# Altium schematic sheet ESP32.SchDoc
size B; SheetNumber: 1; SheetTotal: 2
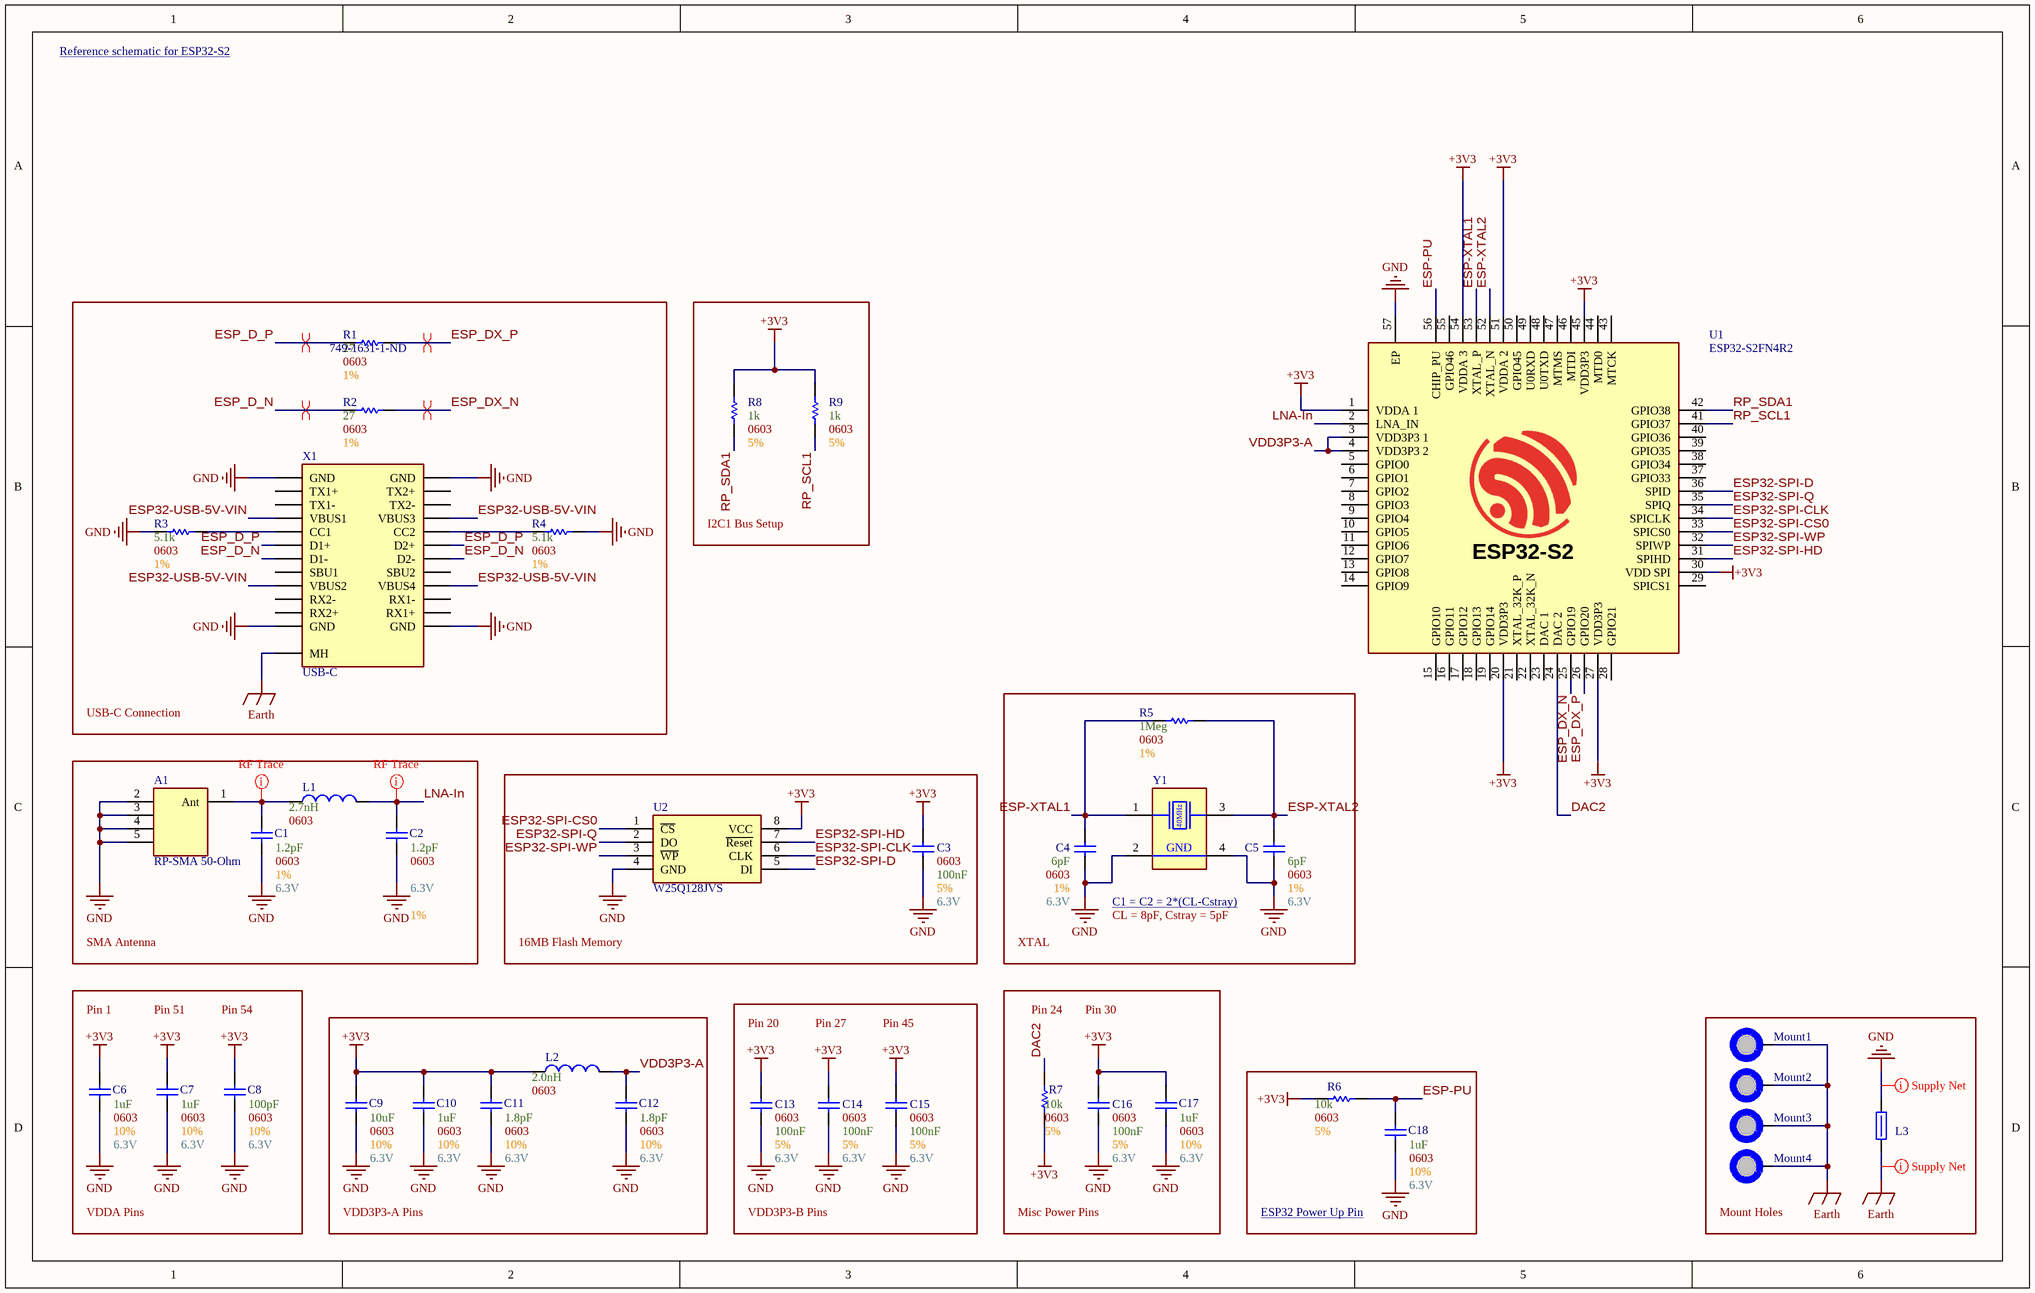
[diagram p0: ESP32.SchDoc]

## Parts
A1  RP-SMA 50-Ohm  [[SMA] RP-SMA 90deg Jack]
C1  Voltage: 6.3V  Tolerance: 1%  Size Package: 0603  Capacitance: 1.2pF  [[Cap] SMD 0603]  (hidden comment: SMD Nonpolarized)
C2  Voltage: 6.3V  Tolerance: 1%  Size Package: 0603  Capacitance: 1.2pF  [[Cap] SMD 0603]  (hidden comment: SMD Nonpolarized)
C3  Size Package: 0603  Capacitance: 100nF  Voltage: 6.3V  Tolerance: 5%  [[Cap] SMD 0603]  (hidden comment: [Cap] SMD Nonpolarized)
C4  Voltage: 6.3V  Tolerance: 1%  Size Package: 0603  Capacitance: 6pF  [[Cap] SMD 0603]  (hidden comment: SMD Nonpolarized)
C5  Voltage: 6.3V  Tolerance: 1%  Size Package: 0603  Capacitance: 6pF  [[Cap] SMD 0603]  (hidden comment: SMD Nonpolarized)
C6  Voltage: 6.3V  Tolerance: 10%  Size Package: 0603  Capacitance: 1uF  [[Cap] SMD 0603]  (hidden comment: SMD Nonpolarized)
C7  Voltage: 6.3V  Tolerance: 10%  Size Package: 0603  Capacitance: 1uF  [[Cap] SMD 0603]  (hidden comment: SMD Nonpolarized)
C8  Voltage: 6.3V  Tolerance: 10%  Size Package: 0603  Capacitance: 100pF  [[Cap] SMD 0603]  (hidden comment: SMD Nonpolarized)
C9  Voltage: 6.3V  Tolerance: 10%  Size Package: 0603  Capacitance: 10uF  [[Cap] SMD 0603]  (hidden comment: SMD Nonpolarized)
C10  Voltage: 6.3V  Tolerance: 10%  Size Package: 0603  Capacitance: 1uF  [[Cap] SMD 0603]  (hidden comment: SMD Nonpolarized)
C11  Voltage: 6.3V  Tolerance: 10%  Size Package: 0603  Capacitance: 1.8pF  [[Cap] SMD 0603]  (hidden comment: SMD Nonpolarized)
C12  Voltage: 6.3V  Tolerance: 10%  Size Package: 0603  Capacitance: 1.8pF  [[Cap] SMD 0603]  (hidden comment: SMD Nonpolarized)
C13  Size Package: 0603  Capacitance: 100nF  Voltage: 6.3V  Tolerance: 5%  [[Cap] SMD 0603]  (hidden comment: [Cap] SMD Nonpolarized)
C14  Size Package: 0603  Capacitance: 100nF  Voltage: 6.3V  Tolerance: 5%  [[Cap] SMD 0603]  (hidden comment: [Cap] SMD Nonpolarized)
C15  Size Package: 0603  Capacitance: 100nF  Voltage: 6.3V  Tolerance: 5%  [[Cap] SMD 0603]  (hidden comment: [Cap] SMD Nonpolarized)
C16  Size Package: 0603  Capacitance: 100nF  Voltage: 6.3V  Tolerance: 5%  [[Cap] SMD 0603]  (hidden comment: [Cap] SMD Nonpolarized)
C17  Voltage: 6.3V  Tolerance: 10%  Size Package: 0603  Capacitance: 1uF  [[Cap] SMD 0603]  (hidden comment: SMD Nonpolarized)
C18  Voltage: 6.3V  Tolerance: 10%  Size Package: 0603  Capacitance: 1uF  [[Cap] SMD 0603]  (hidden comment: SMD Nonpolarized)
L1  Size Package: 0603  Inductance: 2.7nH  [[Inductor] SMD 0603]  (hidden comment: SMD Inductor)
L2  Size Package: 0603  Inductance: 2.0nH  [[Inductor] SMD 0603]  (hidden comment: SMD Inductor)
L3  652-MH2029-300Y  [[Ferrite] SMD Bead 0805 (1)]  (value not drawn)
Mount1  M3 Mount Hole  [[Mount] M3 Mount Hole]  (value not drawn)  (no BOM)
Mount2  M3 Mount Hole  [[Mount] M3 Mount Hole]  (value not drawn)  (no BOM)
Mount3  M3 Mount Hole  [[Mount] M3 Mount Hole]  (value not drawn)  (no BOM)
Mount4  M3 Mount Hole  [[Mount] M3 Mount Hole]  (value not drawn)  (no BOM)
R1  Tolerance: 1%  Resistance: 27  Size Package: 0603  Supplier Part Number 1: 749-1631-1-ND  [[Res] SMD 0603]  (hidden comment: [Res] SMD Resistor)
R2  Tolerance: 1%  Resistance: 27  Size Package: 0603  [[Res] SMD 0603]  (hidden comment: [Res] SMD Resistor)
R3  Tolerance: 1%  Resistance: 5.1k  Size Package: 0603  [[Res] SMD 0603]  (hidden comment: [Res] SMD Resistor)
R4  Tolerance: 1%  Resistance: 5.1k  Size Package: 0603  [[Res] SMD 0603]  (hidden comment: [Res] SMD Resistor)
R5  Tolerance: 1%  Resistance: 1Meg  Size Package: 0603  [[Res] SMD 0603]  (hidden comment: [Res] SMD Resistor)
R6  Tolerance: 5%  Resistance: 10k  Size Package: 0603  [[Res] SMD 0603]  (hidden comment: [Res] SMD Resistor)
R7  Tolerance: 5%  Resistance: 10k  Size Package: 0603  [[Res] SMD 0603]  (hidden comment: [Res] SMD Resistor)
R8  Resistance: 1k  Size Package: 0603  Tolerance: 5%  [[Res] SMD 0603]  (hidden comment: [Res] SMD Resistor)
R9  Resistance: 1k  Size Package: 0603  Tolerance: 5%  [[Res] SMD 0603]  (hidden comment: [Res] SMD Resistor)
U1  ESP32-S2FN4R2  [[MCU] ESP32-S2]
U2  W25Q128JVS  [[Mem] 16Mb Flash Memory]
X1  USB-C  [[Port] USB-C]
Y1  40MHz Crystal  [[XTAL] SMD 40MHz]  (value not drawn)

## Blocks framed on the sheet
USB-C Connection: R1-R4 X1
I2C1 Bus Setup: R8 R9
SMA Antenna: A1 C1 C2 L1
16MB Flash Memory: C3 U2
VDD3P3-A Pins: C9-C12 L2
Mount Holes: L3 Mount1-Mount4
ESP32 Power Up Pin: C18 R6

## Nets
+3V3: C3.2 C6.2 C7.2 C8.2 C9.2 C10.2 C11.2 C13.2 C14.2 C15.2 C16.2 C17.2 L2.1 R6.1 R7.1 R8.2 R9.2 U1.1(VDDA_1) U1.20(VDD3P3) U1.27(VDD3P3) U1.30(VDD_SPI) U1.45(VDD3P3) U1.51(VDDA_2) U1.54(VDDA_3) U2.8(VCC)
Earth: L3.1 Mount1.1 Mount2.1 Mount3.1 Mount4.1 X1.MH
GND: A1.2 A1.3 A1.4 A1.5 C1.1 C2.1 C3.1 C4.1 C5.1 C6.1 C7.1 C8.1 C9.1 C10.1 C11.1 C12.1 C13.1 C14.1 C15.1 C16.1 C17.1 C18.1 L3.2 R3.1 R4.2 U1.57(EP) U2.4(GND) X1.A1(GND) X1.A12(GND) X1.B1(GND) X1.B12(GND) Y1.2(GND) Y1.4(GND)
DAC2: R7.2 U1.24(DAC_2)
ESP32-SPI-CLK: U1.34(SPICLK) U2.6(CLK)
ESP32-SPI-CS0: U1.33(SPICS0) U2.1(~{CS})
ESP32-SPI-D: U1.36(SPID) U2.5(DI)
ESP32-SPI-HD: U1.31(SPIHD) U2.7(~{Reset})
ESP32-SPI-Q: U1.35(SPIQ) U2.2(DO)
ESP32-SPI-WP: U1.32(SPIWP) U2.3(~{WP})
ESP32-USB-5V-VIN: X1.A4(VBUS1) X1.A9(VBUS2) X1.B4(VBUS3) X1.B9(VBUS4)
ESP-PU: C18.2 R6.2 U1.56(CHIP_PU)
ESP-XTAL1: C4.2 R5.2 U1.53(XTAL_P) Y1.1(XTAL1)
ESP-XTAL2: C5.2 R5.1 U1.52(XTAL_N) Y1.3(XTAL2)
ESP_D_N: R2.1 X1.A7(D1-) X1.B7(D2-)
ESP_D_P: R1.1 X1.A6(D1+) X1.B6(D2+)
ESP_DX_N: R2.2 U1.25(GPIO19)
ESP_DX_P: R1.2 U1.26(GPIO20)
LNA-In: C2.2 L1.2 U1.2(LNA_IN)
RP_SCL1: R9.1 U1.41(GPIO37)
RP_SDA1: R8.1 U1.42(GPIO38)
VDD3P3-A: C12.2 L2.2 U1.3(VDD3P3_1) U1.4(VDD3P3_2)
NetA1_1: A1.1(Ant) C1.2 L1.1
NetR3_2: R3.2 X1.A5(CC1)
NetR4_1: R4.1 X1.B5(CC2)

Not connected (* = marked no-connect by the designer): U1 5(GPIO0) 6(GPIO1) 7(GPIO2) 8(GPIO3) 9(GPIO4) 10(GPIO5) 11(GPIO6) 12(GPIO7) 13(GPIO8) 14(GPIO9) 15(GPIO10) 16(GPIO11) 17(GPIO12) 18(GPIO13) 19(GPIO14) 21(XTAL_32K_P) 22(XTAL_32K_N) 23(DAC_1) 28(GPIO21) 29(SPICS1) 37(GPIO33) 38(GPIO34) 39(GPIO35) 40(GPIO36) 43(MTCK) 44(MTD0) 46(MTDI) 47(MTMS) 48(U0TXD) 49(U0RXD) 50(GPIO45) 55(GPIO46); X1 A2(TX1+) A3(TX1-) A8(SBU1) A10(RX2-) A11(RX2+) B2(TX2+) B3(TX2-) B8(SBU2) B10(RX1-) B11(RX1+)

## Layout directives
differential pair: ESP_D_N, ESP_D_P, ESP_DX_P
differential pair; differential pair class USB_Pairs: ESP_DX_N
net class nRF Signal: LNA-In, NetA1_1
net class Supply_Nets: Earth, GND

## Notes on the sheet
- Reference schematic for ESP32-S2 <https://docs.espressif.com/projects/esp-hardware-design-guidelines/en/latest/esp32s2/_images/esp32s2-sche-core.png>
- C1 = C2 = 2*(CL-Cstray) <https://microchip.my.site.com/s/article/Calculating-crystal-load-capacitor>
- XTAL
- CL = 8pF, Cstray = 5pF
- Pin 1
- Pin 51
- Pin 54
- Pin 20
- Pin 27
- Pin 45
- Pin 24
- Pin 30
- VDDA Pins
- VDD3P3-B Pins
- Misc Power Pins
- (in symbol [MCU] ESP32-S2) ESP32-S2
- (in symbol [XTAL] SMD 40MHz) 40MHz

## Library data of the parts
A1 = [SMA] RP-SMA 90deg Jack: PCB.RPSMAFRA.HT; Supplier 1: DigiKey; Supplier Part Number 1: 931-1360-ND
C1 C2 C4-C12 C17 C18 = [Cap] SMD Nonpolarized: Supplier 1: DigiKey
  C1 C2: Supplier Part Number 1: 4713-CHV0603N2501R2BCT-ND
  C4 C5: Supplier Part Number 1: 311-1055-1-ND
  C6 C7 C10 C17 C18: Supplier Part Number 1: 1276-6524-1-ND
  C8: Supplier Part Number 1: 490-1427-1-ND
  C9: Supplier Part Number 1: 587-3258-1-ND
  C11 C12: Supplier Part Number 1: 478-600S1R8BT250XT4KCT-ND
L1 L2 = [Inductor] SMD Inductor: JLC Part #: *; Mouser Part #: *; Supplier 1: DigiKey
  L1: Supplier Part Number 1: 732-7447860027GCT-ND
  L2: Supplier Part Number 1: 490-LQW18AS2N0J00DCT-ND
L3 = [Ferrite] SMD Ferrite Bead (1): Res @ Freq: 30 @ 100MHz; Size Package: 0805; Supplier 1: DigiKey; Supplier Part Number 1: MH2029-300YCT-ND
Mount1-Mount4 = [Mount] M3 Mount Hole: Place at least 4.5mm from board edge. Plated.
R1-R9 = [Res] SMD Resistor: Generic; Supplier 1: DigiKey
  R2: Supplier Part Number 1: 749-1631-1-ND
  R3 R4: Supplier Part Number 1: 311-5.10KHRDKR-ND
  R5: Supplier Part Number 1: YAG4498CT-ND
  R6 R7: Supplier Part Number 1: 311-10.0KHRCT-ND
  R8 R9: Supplier Part Number 1: P2.0KBDCT-ND
U1 = [MCU] ESP32-S2: Supplier 1: DigiKey; Supplier Part Number 1: 1965-ESP32-S2FN4R2CT-ND
U2 = [Mem] 16Mb Flash Memory: W25Q128JVSIQ TR; Supplier 1: DigiKey; Supplier Part Number 1: 256-W25Q128JVSIQTRCT-ND
X1 = [Port] USB Type-C: Supplier 1: DigiKey; Supplier Part Number 1: 670-3104-1-ND
Y1 = [XTAL] SMD 40MHz: CX2016DB40000D0FLJCC; Supplier 1: DigiKey; Supplier Part Number 1: 478-CX2016DB40000D0FLJCCDKR-ND
C3 C13-C16 = [Cap] SMD Nonpolarized: Supplier 1: DigiKey; Supplier Part Number 1: 311-1088-6-ND